# EAGLE schematic leds (EAGLE 6.5.0)
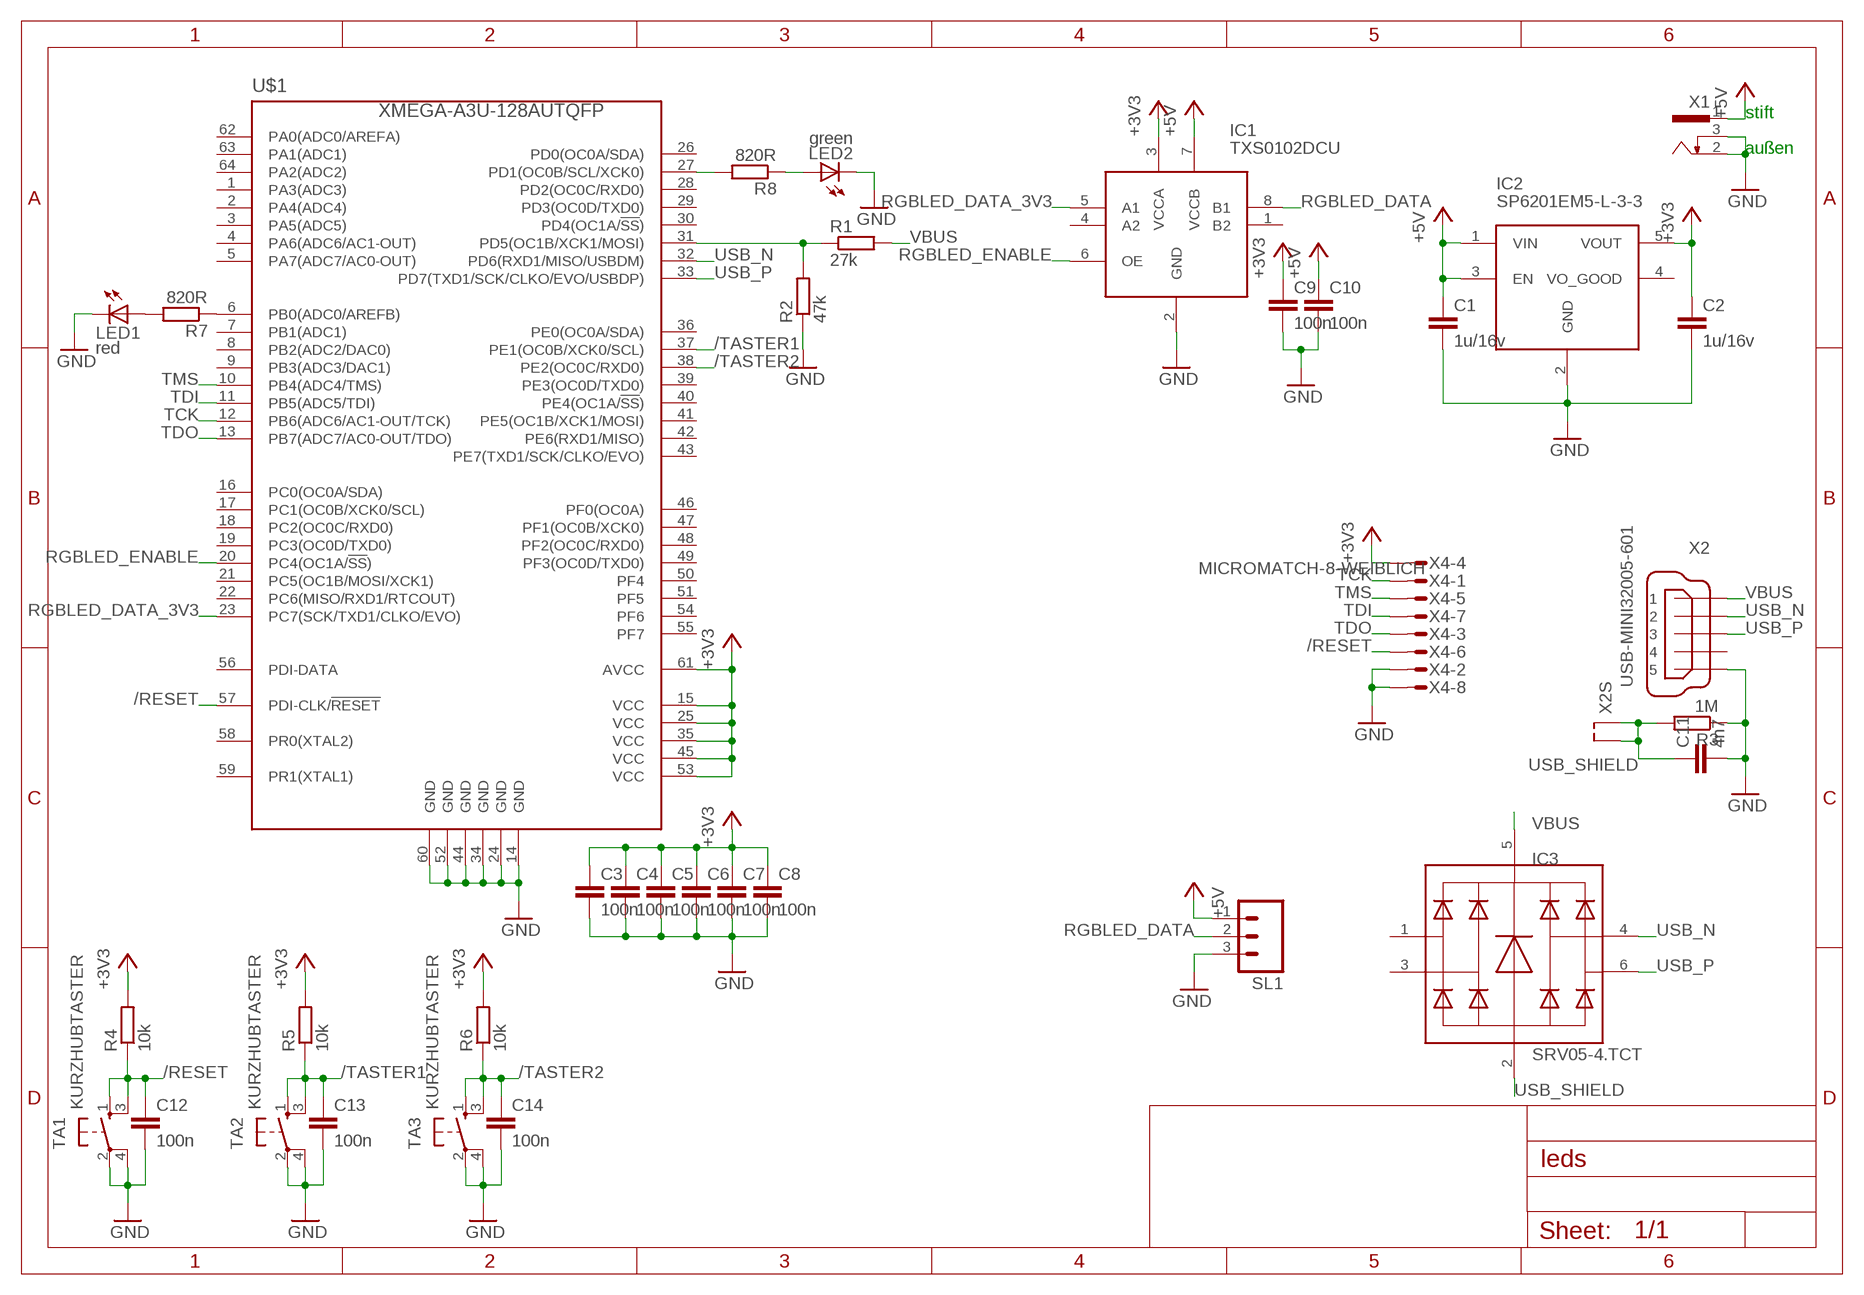
[diagram p0: schematic, sheet 1]

## Parts
C1  1u/16v  C-EUC0603  [C0603]
C2  1u/16v  C-EUC0603  [C0603]
C3  100n  C-EUC0603  [C0603]
C4  100n  C-EUC0603  [C0603]
C5  100n  C-EUC0603  [C0603]
C6  100n  C-EUC0603  [C0603]
C7  100n  C-EUC0603  [C0603]
C8  100n  C-EUC0603  [C0603]
C9  100n  C-EUC0603  [C0603]
C10  100n  C-EUC0603  [C0603]
C11  4n7  C-EUC0603  [C0603]
C12  100n  C-EUC0603  [C0603]
C13  100n  C-EUC0603  [C0603]
C14  100n  C-EUC0603  [C0603]
IC1  TXS0102DCU  [DCU8]
IC2  SP6201EM5-L-3-3  [SOT23-5]
IC3  SRV05-4.TCT  [SOT23-6]
LED1  red  LEDLRCHIPLED_0603  [CHIPLED_0603]
LED2  green  LEDLGCHIPLED_0603  [CHIPLED_0603]
R1  27k  R-EU_R0603  [R0603]
R2  47k  R-EU_R0603  [R0603]
R3  1M  R-EU_R0603  [R0603]
R4  10k  R-EU_R0603  [R0603]
R5  10k  R-EU_R0603  [R0603]
R6  10k  R-EU_R0603  [R0603]
R7  820R  R-EU_R0603  [R0603]
R8  820R  R-EU_R0603  [R0603]
SL1  M03  [03P]
TA1  KURZHUBTASTER  [TA93XX]
TA2  KURZHUBTASTER  [TA93XX]
TA3  KURZHUBTASTER  [TA93XX]
U$1  XMEGA-A3U-128AUTQFP  [TQFP64]
X1  733980-62  [733980-62]
X2  USB-MINI32005-601  [32005-601]
X4  MICROMATCH-8-WEIBLICH  [MICROMATCH-8]

## Nets
+3V3: C2.1 C3.1 C4.1 C5.1 C6.1 C7.1 C8.1 C9.1 IC1.3(VCCA) IC2.5(VOUT) R4.2 R5.2 R6.2 U$1.15(VCC) U$1.25(VCC) U$1.35(VCC) U$1.45(VCC) U$1.53(VCC) U$1.61(AVCC) X4.4
+5V: C1.1 C10.1 IC1.7(VCCB) IC2.1(VIN) IC2.3(EN) SL1.1 X1.1
/RESET: C12.1 R4.1 TA1.1(S) TA1.3(S1) U$1.57(PDI-CLK/!RESET) X4.6
/TASTER1: C13.1 R5.1 TA2.1(S) TA2.3(S1) U$1.37(PE1(OC0B/XCK0/SCL))
/TASTER2: C14.1 R6.1 TA3.1(S) TA3.3(S1) U$1.38(PE2(OC0C/RXD0))
GND: C1.2 C2.2 C3.2 C4.2 C5.2 C6.2 C7.2 C8.2 C9.2 C10.2 C11.2 C12.2 C13.2 C14.2 IC1.2(GND) IC2.2(GND) LED1.C LED2.C R2.1 R3.1 SL1.3 TA1.2(P) TA1.4(P1) TA2.2(P) TA2.4(P1) TA3.2(P) TA3.4(P1) U$1.14(GND) U$1.24(GND) U$1.34(GND) U$1.44(GND) U$1.52(GND) U$1.60(GND) X1.2 X1.3 X2.5 X4.2 X4.8
N$1: R1.1 R2.2 U$1.31(PD5(OC1B/XCK1/MOSI))
N$2: R7.1 U$1.6(PB0(ADC0/AREFB))
N$3: LED1.A R7.2
N$4: R8.2 U$1.27(PD1(OC0B/SCL/XCK0))
N$5: LED2.A R8.1
RGBLED_DATA: IC1.8(B1) SL1.2
RGBLED_DATA_3V3: IC1.5(A1) U$1.23(PC7(SCK/TXD1/CLKO/EVO))
RGBLED_ENABLE: IC1.6(OE) U$1.20(PC4(OC1A/!SS!))
TCK: U$1.12(PB6(ADC6/AC1-OUT/TCK)) X4.1
TDI: U$1.11(PB5(ADC5/TDI)) X4.7
TDO: U$1.13(PB7(ADC7/AC0-OUT/TDO)) X4.3
TMS: U$1.10(PB4(ADC4/TMS)) X4.5
USB_N: IC3.4 U$1.32(PD6(RXD1/MISO/USBDM)) X2.2
USB_P: IC3.6 U$1.33(PD7(TXD1/SCK/CLKO/EVO/USBDP)) X2.3
USB_SHIELD: C11.1 IC3.2(A) R3.2 X2.M1(S1) X2.M2(S2)
VBUS: IC3.5(K) R1.2 X2.1
Unconnected: IC1.1(B2) IC1.4(A2) IC2.4(VO_GOOD) IC3.1 IC3.3 U$1.1(PA3(ADC3)) U$1.2(PA4(ADC4)) U$1.3(PA5(ADC5)) U$1.4(PA6(ADC6/AC1-OUT)) U$1.5(PA7(ADC7/AC0-OUT)) U$1.7(PB1(ADC1)) U$1.8(PB2(ADC2/DAC0)) U$1.9(PB3(ADC3/DAC1)) U$1.16(PC0(OC0A/SDA)) U$1.17(PC1(OC0B/XCK0/SCL)) U$1.18(PC2(OC0C/RXD0)) U$1.19(PC3(OC0D/TXD0)) U$1.21(PC5(OC1B/MOSI/XCK1)) U$1.22(PC6(MISO/RXD1/RTCOUT)) U$1.26(PD0(OC0A/SDA)) U$1.28(PD2(OC0C/RXD0)) U$1.29(PD3(OC0D/TXD0)) U$1.30(PD4(OC1A/!SS!)) U$1.36(PE0(OC0A/SDA)) U$1.39(PE3(OC0D/TXD0)) U$1.40(PE4(OC1A/!SS!)) U$1.41(PE5(OC1B/XCK1/MOSI)) U$1.42(PE6(RXD1/MISO)) U$1.43(PE7(TXD1/SCK/CLKO/EVO)) U$1.46(PF0(OC0A)) U$1.47(PF1(OC0B/XCK0)) U$1.48(PF2(OC0C/RXD0)) U$1.49(PF3(OC0D/TXD0)) U$1.50(PF4) U$1.51(PF5) U$1.54(PF6) U$1.55(PF7) U$1.56(PDI-DATA) U$1.58(PR0(XTAL2)) U$1.59(PR1(XTAL1)) U$1.62(PA0(ADC0/AREFA)) U$1.63(PA1(ADC1)) U$1.64(PA2(ADC2)) X2.4

## Notes on the sheet
- stift
- außen

## Library data of the parts
C1-C14 = rcl:C-EU: CAPACITOR, European symbol
IC1 = TURAG_misc:TXS0102: I2C/UART-Levelshifter; FARNELL: 1703315
IC2 = TURAG_Spannungsversorgung:SP6201: Linearregler verfügbare Ausgangsspannungen: 1,8V 2,5V 2,895V 3,3V 5,0V; FARNELL: 9388184
IC3 = TURAG_Diode:SRV05-4: SRV05-4.TCT bzw. WE-TVS TVS Diode – High Speed Series; FARNELL: 1456415; WUERTH: 824001
LED1 = led:LED: LED OSRAM: - CHIPLED LG R971, LG N971, LY N971, LG Q971, LY Q971, LO R971, LY R971 LH N974, LH R974 LS Q976, LO Q976, LY Q976 LO Q996 - Hyper CHIPLED LW Q18S LB Q993, LB Q99A, LB R99A - SideLED LS A670, LO A670, LY A670, LG A670, LP A670 LB A673, LV A673, LT A673, LW A673 LH A674 LY A675 LS A676, LA A676, LO A676, LY A676, LW A676 LS A679, LY A679, LG A679 - Hyper Micro SIDELED® LS Y876, LA Y876, LO Y876, LY Y876 LT Y87S - SmartLED LW L88C, LW L88S LB L89C, LB L89S, LG L890 LS L89K, LO L89K, LY L89K LS L896, LA L896, LO L896, LY L896 - TOPLED LS T670, LO T670, LY T670, LG T670, LP T670 LSG T670, LSP T670, LSY T670, LOP T670, LYG T670 LG T671, LOG T671, LSG T671 LB T673, LV T673, LT T673, LW T673 LH T674 LS T676, LA T676, LO T676, LY T676, LB T676, LH T676, LSB T676, LW T676 LB T67C, LV T67C, LT T67C, LS T67K, LO T67K, LY T67K, LW E67C LS E67B, LA E67B, LO E67B, LY E67B, LB E67C, LV E67C, LT E67C LW T67C LS T679, LY T679, LG T679 LS T770, LO T770, LY T770, LG T770, LP T770 LB T773, LV T773, LT T773, LW T773 LH T774 LS E675, LA E675, LY E675, LS T675 LS T776, LA T776, LO T776, LY T776, LB T776 LHGB T686 LT T68C, LB T68C - Hyper Mini TOPLED® LB M676 - Mini TOPLED Santana® LG M470 LS M47K, LO M47K, LY M47K Source: http://www.osram.convergy.de LUXEON: - LUMILED® LXK2-PW12-R00, LXK2-PW12-S00, LXK2-PW14-U00, LXK2-PW14-V00 LXK2-PM12-R00, LXK2-PM12-S00, LXK2-PM14-U00 LXK2-PE12-Q00, LXK2-PE12-R00, LXK2-PE12-S00, LXK2-PE14-T00, LXK2-PE14-U00 LXK2-PB12-K00, LXK2-PB12-L00, LXK2-PB12-M00, LXK2-PB14-N00, LXK2-PB14-P00, LXK2-PB14-Q00 LXK2-PR12-L00, LXK2-PR12-M00, LXK2-PR14-Q00, LXK2-PR14-R00 LXK2-PD12-Q00, LXK2-PD12-R00, LXK2-PD12-S00 LXK2-PH12-R00, LXK2-PH12-S00 LXK2-PL12-P00, LXK2-PL12-Q00, LXK2-PL12-R00 Source: www.luxeon.com KINGBRIGHT: KA-3528ASYC Source: www.kingbright.com; REICHELT: LS L29K
LED2 = led:LED: LED OSRAM: - CHIPLED LG R971, LG N971, LY N971, LG Q971, LY Q971, LO R971, LY R971 LH N974, LH R974 LS Q976, LO Q976, LY Q976 LO Q996 - Hyper CHIPLED LW Q18S LB Q993, LB Q99A, LB R99A - SideLED LS A670, LO A670, LY A670, LG A670, LP A670 LB A673, LV A673, LT A673, LW A673 LH A674 LY A675 LS A676, LA A676, LO A676, LY A676, LW A676 LS A679, LY A679, LG A679 - Hyper Micro SIDELED® LS Y876, LA Y876, LO Y876, LY Y876 LT Y87S - SmartLED LW L88C, LW L88S LB L89C, LB L89S, LG L890 LS L89K, LO L89K, LY L89K LS L896, LA L896, LO L896, LY L896 - TOPLED LS T670, LO T670, LY T670, LG T670, LP T670 LSG T670, LSP T670, LSY T670, LOP T670, LYG T670 LG T671, LOG T671, LSG T671 LB T673, LV T673, LT T673, LW T673 LH T674 LS T676, LA T676, LO T676, LY T676, LB T676, LH T676, LSB T676, LW T676 LB T67C, LV T67C, LT T67C, LS T67K, LO T67K, LY T67K, LW E67C LS E67B, LA E67B, LO E67B, LY E67B, LB E67C, LV E67C, LT E67C LW T67C LS T679, LY T679, LG T679 LS T770, LO T770, LY T770, LG T770, LP T770 LB T773, LV T773, LT T773, LW T773 LH T774 LS E675, LA E675, LY E675, LS T675 LS T776, LA T776, LO T776, LY T776, LB T776 LHGB T686 LT T68C, LB T68C - Hyper Mini TOPLED® LB M676 - Mini TOPLED Santana® LG M470 LS M47K, LO M47K, LY M47K Source: http://www.osram.convergy.de LUXEON: - LUMILED® LXK2-PW12-R00, LXK2-PW12-S00, LXK2-PW14-U00, LXK2-PW14-V00 LXK2-PM12-R00, LXK2-PM12-S00, LXK2-PM14-U00 LXK2-PE12-Q00, LXK2-PE12-R00, LXK2-PE12-S00, LXK2-PE14-T00, LXK2-PE14-U00 LXK2-PB12-K00, LXK2-PB12-L00, LXK2-PB12-M00, LXK2-PB14-N00, LXK2-PB14-P00, LXK2-PB14-Q00 LXK2-PR12-L00, LXK2-PR12-M00, LXK2-PR14-Q00, LXK2-PR14-R00 LXK2-PD12-Q00, LXK2-PD12-R00, LXK2-PD12-S00 LXK2-PH12-R00, LXK2-PH12-S00 LXK2-PL12-P00, LXK2-PL12-Q00, LXK2-PL12-R00 Source: www.luxeon.com KINGBRIGHT: KA-3528ASYC Source: www.kingbright.com; REICHELT: LG L29K
R1-R8 = rcl:R-EU_: RESISTOR, European symbol
SL1 = con-amp-quick:M03: AMP QUICK CONNECTOR; REICHELT: PSS 254/3G:PSK 254/3W
TA1-TA3 = TURAG_Schalter-Relais:KURZHUBTASTER; REICHELT: Taster 9314; WUERTH: 430 182 043 816
U$1 = atmel:XMEGA-A3U: Atmel XMega A3 series processor; FARNELL: 2066298
X1 = con-conrad:73398?: FEMALE PRINT CONNECTOR Niedervolt-Steckverbinder Distributor Conrad; REICHELT: HEBW 21
X2 = TURAG_Steckverbinder:USB-MINI: MINI USB-B R/A DIP 5pol. Source: www.cypressindustries.com; REICHELT: USB BWM
X4 = con-amp-micromatch:MICROMATCH-8: MicroMaTch 8 7-215464-8 / 0-215464-8 Drawing Number C-215464 DDEController.pdf; REICHELT: MM FL 8G:MM SL 8SK